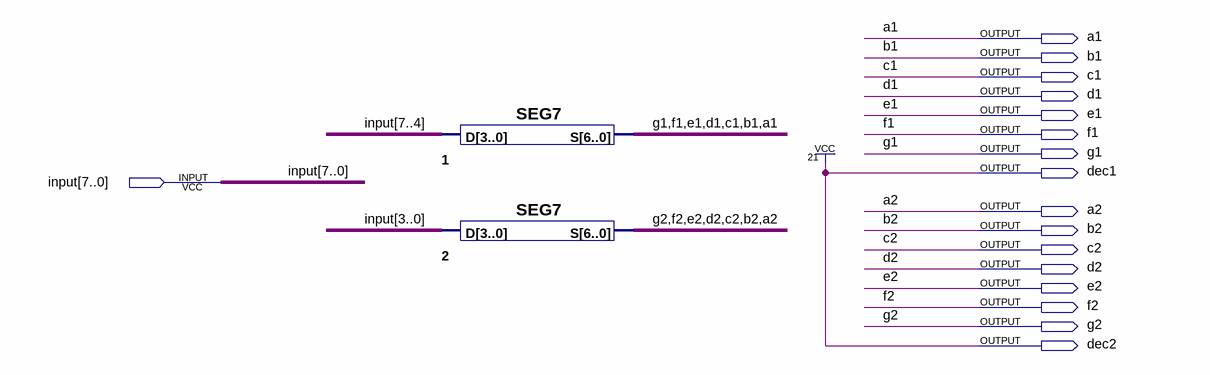
[diagram p0: schematic sheet]
// Quartus schematic sevensegcontroller.bdf as structural Verilog: 2 symbols, 17 pins
module sevensegcontroller (
  input  [7:0] \input ,
  output a1,
  output b1,
  output c1,
  output d1,
  output e1,
  output f1,
  output g1,
  output dec1,
  output a2,
  output b2,
  output c2,
  output d2,
  output e2,
  output f2,
  output g2,
  output dec2
);

  SEG7 u_1 (.D(\input [7:4]), .S({g1, f1, e1, d1, c1, b1, a1}));
  SEG7 u_2 (.D(\input [3:0]), .S({g2, f2, e2, d2, c2, b2, a2}));

  assign dec1 = 1'b1;
  assign dec2 = 1'b1;
endmodule
